# EAGLE design GDOv5 Board (EAGLE 7.5.0)
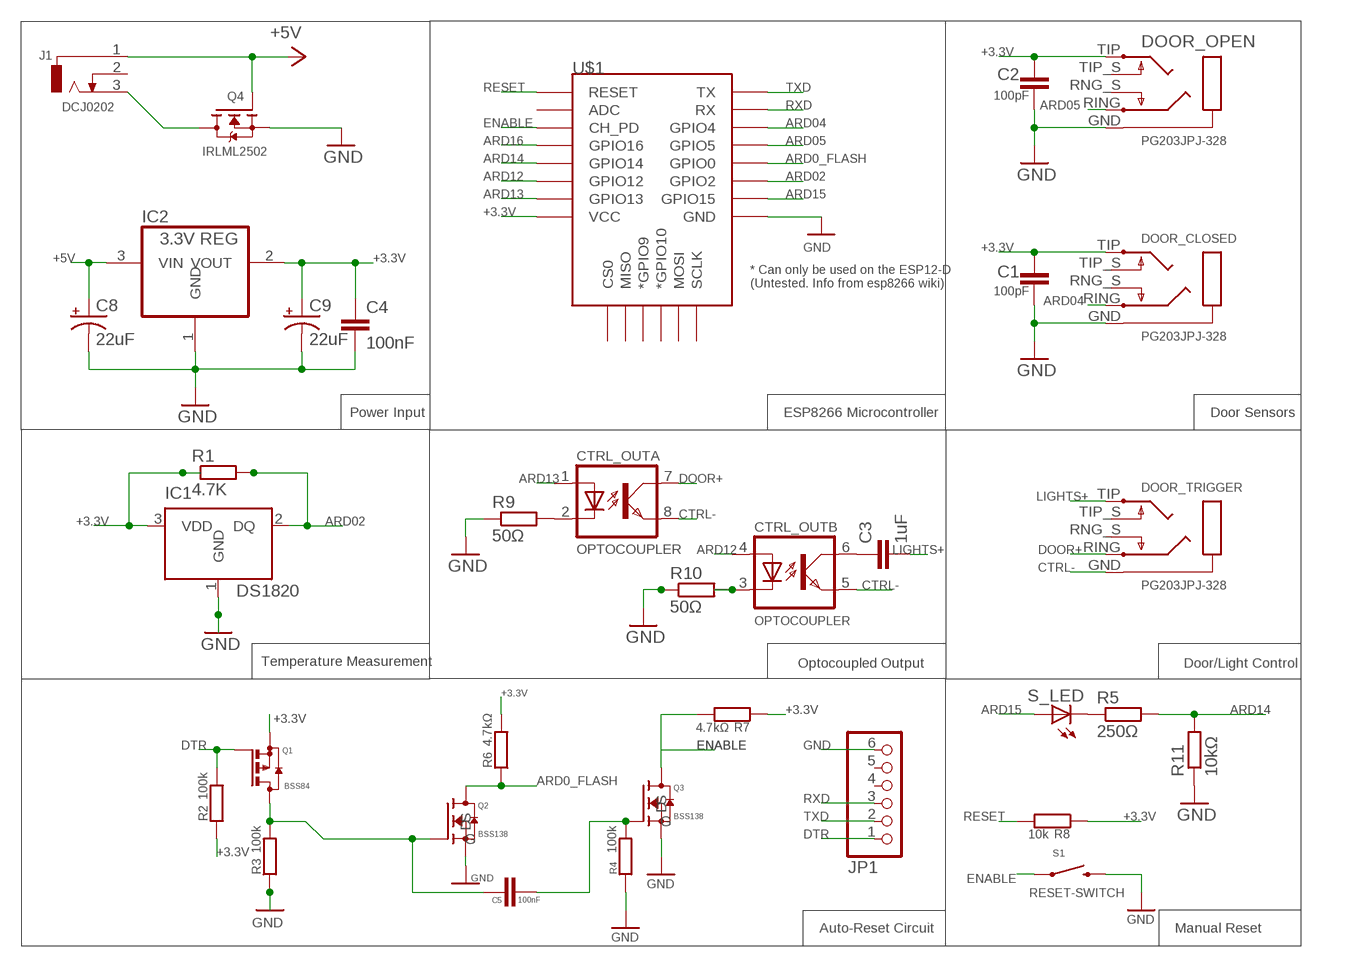
[diagram p0: schematic, sheet 1]

## Parts
C1  100pF  C-EUC1206  [C1206]
C2  100pF  C-EUC1206  [C1206]
C3  1uF  CAP1206  [1206]
C4  100nF  C-EUC1206  [C1206]
C5  100nF  C-EUC1206  [C1206]
C8  22uF  10UF-TANT  [EIA3216]
C9  22uF  10UF-TANT  [EIA3216]
CTRL_OUT  OPTOCOUPLER  ILD2  [DIL08]
DOOR_CLOSED  PG203JPJ-328  [PG203J]
DOOR_OPEN  PG203JPJ-328  [PG203J]
DOOR_TRIGGER  PG203JPJ-328  [PG203J]
IC1  DS1820  [TO-92]
IC2  3.3V REG  REG1117  [SOT223]
J1  DCJ0202  [DCJ0202]
JP1  PINHD-1X6  [1X06]
Q1  BSS84  [SOT23]
Q2  BSS138  [BSS138]
Q3  BSS138  [BSS138]
Q4  IRLML2502  BSS138  [SOT23]
R1  4.7K  R-EU_M3216  [M3216]
R2  100k  R-EU_M3216  [M3216]
R3  100k  R-EU_M3216  [M3216]
R4  100k  R-EU_M3216  [M3216]
R5  250Ω  R-EU_M3216  [M3216]
R6  4.7kΩ  R-EU_M3216  [M3216]
R7  4.7kΩ  R-EU_M3216  [M3216]
R8  10k  R-EU_M3216  [M3216]
R9  50Ω  R-EU_M3216  [M3216]
R10  50Ω  R-EU_M3216  [M3216]
R11  10kΩ  R-EU_M3216  [M3216]
S1  RESET-SWITCH  SWITCH-MOMENTARY-2-SMD-1101NE  [TACTILE-SWITCH-1101NE]
S_LED  LED5MM  [LED5MM]
U$1  ESP12ESMD  [ESP12E-SMD]

## Nets
+3.3V: C1.1 C2.1 C4.1 C9.A(+) DOOR_CLOSED.TIP DOOR_OPEN.TIP IC1.3(VDD) IC2.2(VOUT) Q1.2(S) R1.1 R2.1 R6.2 R7.1 R8.1 U$1.VCC
+5V: C8.A(+) IC2.3(VIN) J1.1 Q4.1(G)
ARD0_FLASH: Q2.D R6.1 U$1.GPIO0
ARD02: IC1.2(DQ) R1.2 U$1.GPIO2
ARD04: DOOR_CLOSED.RING U$1.GPIO4
ARD05: DOOR_OPEN.RING U$1.GPIO5
ARD12: CTRL_OUT.4(B:A) U$1.GPIO12
ARD13: CTRL_OUT.1(A:A) U$1.GPIO13
ARD14: R5.2 R11.2 U$1.GPIO14
ARD15: S_LED.A U$1.GPIO15
ARD16: U$1.GPIO16
CTRL-: CTRL_OUT.5(B:EMIT) CTRL_OUT.8(A:EMIT) DOOR_TRIGGER.GND
DOOR+: CTRL_OUT.7(A:COL) DOOR_TRIGGER.RING
DTR: JP1.1 Q1.1(G) R2.2
ENABLE: Q3.D R7.2 S1.P$1 U$1.CH_PD
GND: C1.2 C2.2 C4.2 C8.C(-) C9.C(-) DOOR_CLOSED.GND DOOR_OPEN.GND IC1.1(GND) IC2.1(GND) JP1.6 Q2.S Q3.S Q4.2(S) R3.1 R4.1 R9.1 R10.1 R11.1 S1.P$2 U$1.GND
LIGHTS+: C3.2 DOOR_TRIGGER.TIP
N$1: J1.3 Q4.3(D)
N$2: C5.2 Q3.G R4.2
N$3: C3.1 CTRL_OUT.6(B:COL)
N$4: R5.1 S_LED.K(C)
N$5: C5.1 Q1.3(D) Q2.G R3.2
N$6: CTRL_OUT.2(A:C) R9.2
N$7: CTRL_OUT.3(B:C) R10.2
RESET: R8.2 U$1.RESET
RXD: JP1.3 U$1.RXD0(RX)
TXD: JP1.2 U$1.TXD0(TX)
Unconnected: DOOR_CLOSED.RNG_S DOOR_CLOSED.TIP_S DOOR_OPEN.RNG_S DOOR_OPEN.TIP_S DOOR_TRIGGER.RNG_S DOOR_TRIGGER.TIP_S J1.2 JP1.4 JP1.5 U$1.ADC U$1.CS0 U$1.GPIO9(*GPIO9) U$1.GPIO10(*GPIO10) U$1.MISO U$1.MOSI U$1.SCLK

## Notes on the sheet
- Power Input | ESP8266 Microcontroller | Door Sensors
- Temperature Measurement | Optocoupled Output | Door/Light Control
- Auto-Reset Circuit | Manual Reset

## Library data of the parts
C1 C2 C4 C5 = resistor:C-EU: CAPACITOR, European symbol
C3 = SparkFun-Capacitors:CAP: Capacitor Standard 0603 ceramic capacitor, and 0.1" leaded capacitor.
C8 C9 = SparkFun-Capacitors:10UF-TANT: 10uF Tantalum SMT CAP-00811- 16V 10% (EIA-3216); PROD_ID: CAP-00811; VALUE: 10uF
CTRL_OUT = optocoupler:ILD2: SIEMENS OPTO COUPLER; OC_FARNELL: 1469596; OC_NEWARK: unknown
DOOR_CLOSED DOOR_OPEN DOOR_TRIGGER = PJ-328 Jack:PG203J: 3.5mm Mic/Headphone Jack Stereo microphone/headphone jack PJ-328
IC1 = DS1820:DS1820: DS1820 - 1-Wire Digital Thermometer
IC2 = burr-brown:REG1117: 800mA and 1A Low Dropout (LDO) Positive Regulator 1.8V, 2.5V, 2.85V, 3.3V, 5V, and Adj; MPN: REG1117; OC_FARNELL: 1097566; OC_NEWARK: 14P6981
J1 = con-jack:DCJ0202: DC POWER JACK Source: DCJ0202.pdf; OC_FARNELL: unknown; OC_NEWARK: unknown
JP1 = adafruit:PINHD-1X6: PIN HEADER
Q1 = transistor-small-signal:BSS84: P-CHANNEL MOS FET
Q2 Q3 = Ava:BSS138: BSS138 N-Channel Logic Level Enhancement Mode Field Effect Transistor Source: http://www.fairchildsemi.com/datasheets/BS/BSS138.pdf
Q4 = bss138_10:BSS138: BSS138 N-Channel Logic Level Enhancement Mode Field Effect Transistor Source: http://www.fairchildsemi.com/datasheets/BS/BSS138.pdf; MF: Fairchild; MPN: BSS138; OC_FARNELL: 9845330; OC_NEWARK: 67R2009
R1-R11 = resistor:R-EU_: RESISTOR, European symbol
S1 = SparkFun-Electromechanical:SWITCH-MOMENTARY-2: Various NO switches- pushbuttons, reed, etc
S_LED = adafruit:LED: LED OSRAM: - CHIPLED LG R971, LG N971, LY N971, LG Q971, LY Q971, LO R971, LY R971 LH N974, LH R974 LS Q976, LO Q976, LY Q976 LO Q996 - Hyper CHIPLED LW Q18S LB Q993, LB Q99A, LB R99A - SideLED LS A670, LO A670, LY A670, LG A670, LP A670 LB A673, LV A673, LT A673, LW A673 LH A674 LY A675 LS A676, LA A676, LO A676, LY A676, LW A676 LS A679, LY A679, LG A679 - Hyper Micro SIDELED® LS Y876, LA Y876, LO Y876, LY Y876 LT Y87S - SmartLED LW L88C, LW L88S LB L89C, LB L89S, LG L890 LS L89K, LO L89K, LY L89K LS L896, LA L896, LO L896, LY L896 - TOPLED LS T670, LO T670, LY T670, LG T670, LP T670 LSG T670, LSP T670, LSY T670, LOP T670, LYG T670 LG T671, LOG T671, LSG T671 LB T673, LV T673, LT T673, LW T673 LH T674 LS T676, LA T676, LO T676, LY T676, LB T676, LH T676, LSB T676, LW T676 LB T67C, LV T67C, LT T67C, LS T67K, LO T67K, LY T67K, LW E67C LS E67B, LA E67B, LO E67B, LY E67B, LB E67C, LV E67C, LT E67C LW T67C LS T679, LY T679, LG T679 LS T770, LO T770, LY T770, LG T770, LP T770 LB T773, LV T773, LT T773, LW T773 LH T774 LS E675, LA E675, LY E675, LS T675 LS T776, LA T776, LO T776, LY T776, LB T776 LHGB T686 LT T68C, LB T68C - Hyper Mini TOPLED® LB M676 - Mini TOPLED Santana® LG M470 LS M47K, LO M47K, LY M47K Source: http://www.osram.convergy.de/
U$1 = esp8266modules:ESP12E: ESP12E Module

## Board
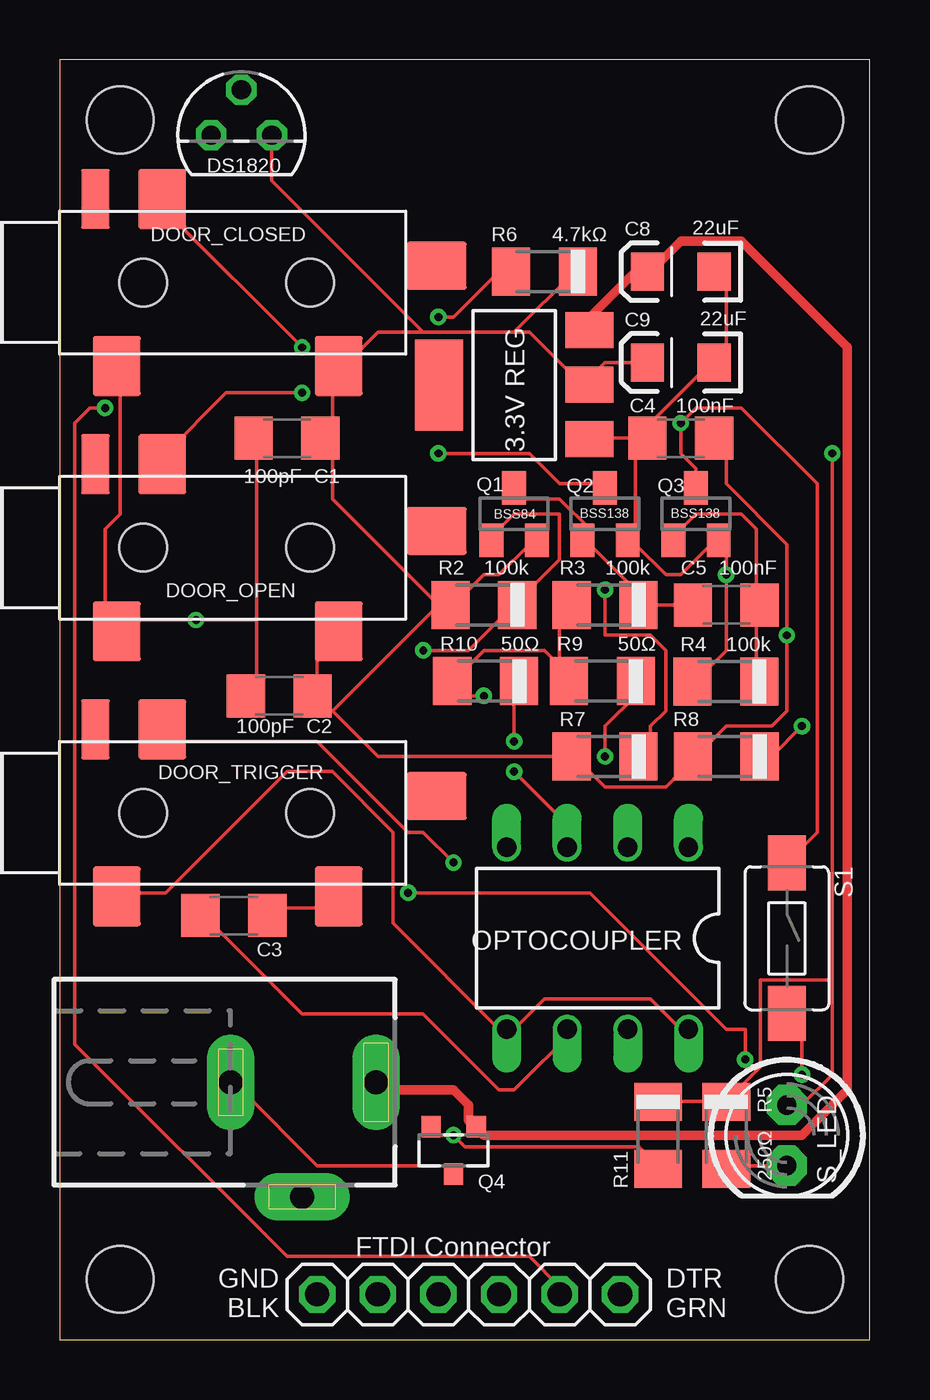
[diagram p1: board, top side]
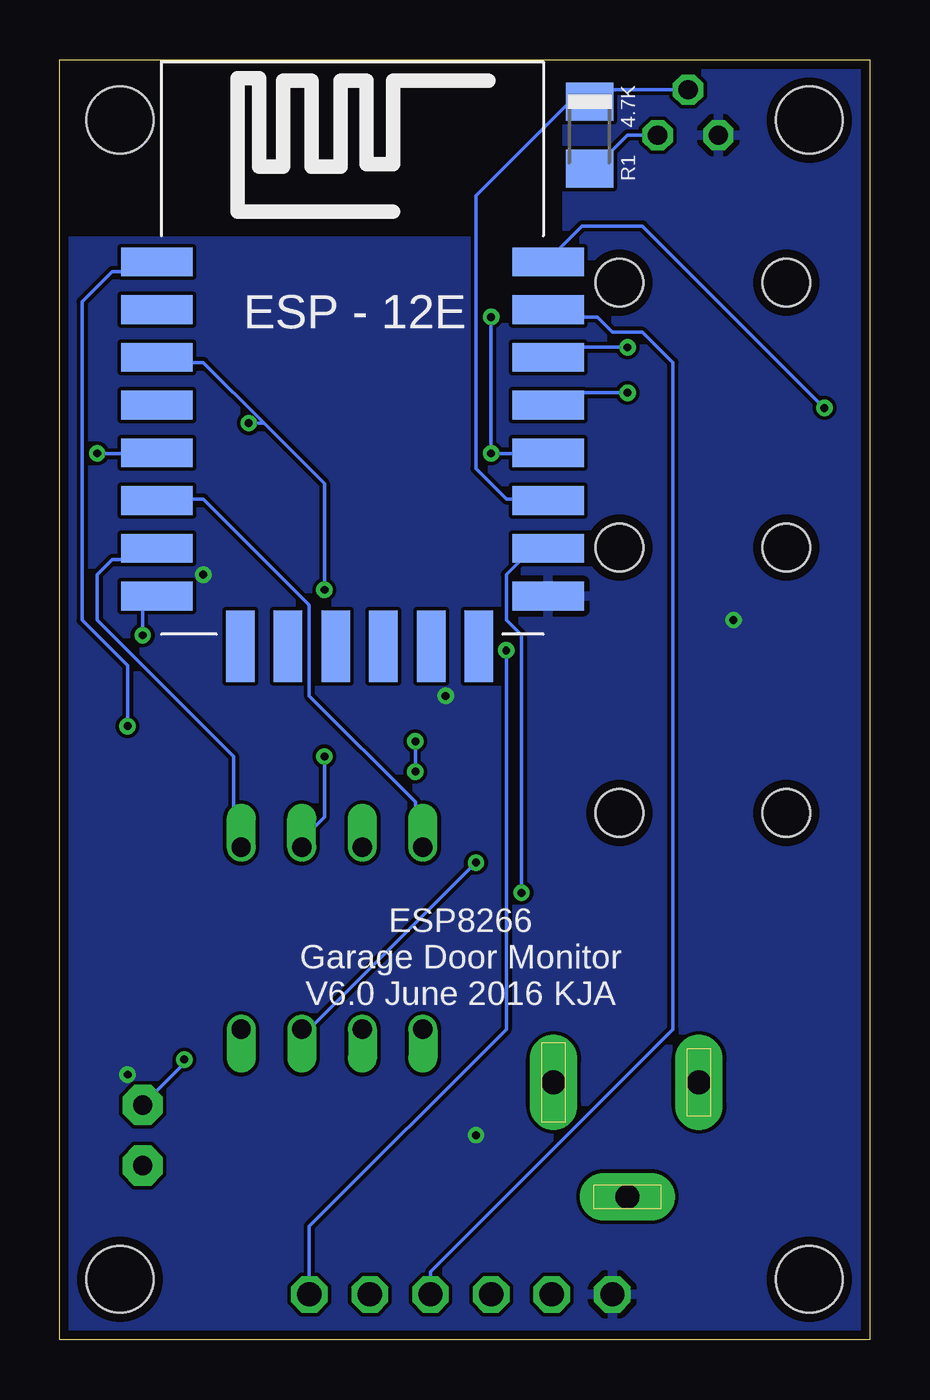
[diagram p2: board, bottom side, seen from below]

Size 33.96 x 53.65 mm. Coordinates in mm from the lower left corner, seen from the top.
Outline: 0,0 33.96,0 33.96,53.65 0,53.65 0,0
Copper layers (1*16): Top 0.0356mm / dielectric 1.5011mm / Bottom 0.0356mm
Design rules "oshpark-2layer": minimum track width 6mil, minimum drill 13mil, track to track 6mil, track to pad 6mil, pad to pad 6mil, via to via 6mil, smd to smd 6mil, copper to edge 15mil, drill to drill 6mil, minimum pad ring 7mil, minimum via ring 7mil, stop-mask expansion 2.5mil, vias tented up to drill 0mil, thermal gap 10mil
Holes 2.8 mm at 2.54,51.12 31.43,51.12 31.43,2.54 2.54,2.54
tRestrict: area 13.3,46.7 to 33.3,53.3

### Footprints (pad centres in the part's own frame; a part is rotated, then mirrored left to right if it is on the bottom)
C1206 = smd 1.6 x 1.8: 1 -1.4,0; 2 1.4,0
1206 = smd 1.6 x 1.8: 1 -1.4,0; 2 1.4,0
EIA3216 = smd 1.4 x 1.6: A 1.4,0; C -1.4,0
DIL08 = drill 0.813 offset: 1 -3.81,-3.81; 2 -1.27,-3.81; 3 1.27,-3.81; 4 3.81,-3.81; 5 3.81,3.81; 6 1.27,3.81; 7 -1.27,3.81; 8 -3.81,3.81
PG203J = smd 2 x 2.5: GND 2.4,-6.5; RING 4.3,0.5; TIP 11.7,-6.5 | smd 1.2 x 2.5: RNG_S 1.5,0.5 | smd 2.5 x 2: TIP_S 15.8,-2.3 | hole 2: 3.5,-3; 10.5,-3
TO-92 = drill 0.813 pad 1.27 octagon: 1 -1.27,0; 2 0,1.905; 3 1.27,0
SOT223 = smd 1.499 x 2.007: 1 -2.261,-3.15; 2 0.025,-3.15; 3 2.311,-3.15 | smd 3.81 x 2.007: 4 0,3.15
DCJ0202 = drill 1 pad 2 long: 1 0,3.1; 2 4.8,0; 3 0,-3
1X06 = drill 1.016 octagon: 1 -6.35,0; 2 -3.81,0; 3 -1.27,0; 4 1.27,0; 5 3.81,0; 6 6.35,0
SOT23 = smd 1 x 1.4: 1 -0.95,-1.1; 2 0.95,-1.1; 3 0,1.1
BSS138 = smd 1 x 1.4: D 0,1.1; G -0.95,-1.1; S 0.95,-1.1
SOT23' = smd 0.8 x 0.9: 1 -0.95,-1; 2 0.95,-1; 3 0,1
M3216 = smd 1.6 x 2: 1 -1.4,0; 2 1.4,0
TACTILE-SWITCH-1101NE = smd 2.3 x 1.6: P$1 -3.15,0; P$2 3.15,0
LED5MM = drill 0.813 pad 1.676 octagon: A -1.27,0; K 1.27,0
ESP12E-SMD = smd 3 x 1.2: ADC -8.3,3.8; CH_PD -8.3,1.8; GND 8.1,-8.2; GPIO0 8.1,-2.2; GPIO2 8.1,-4.2; GPIO4 8.1,1.8; GPIO5 8.1,-0.2; GPIO12 -8.3,-4.2; GPIO13 -8.3,-6.2; GPIO14 -8.3,-2.2; GPIO15 8.1,-6.2; GPIO16 -8.3,-0.2; RESET -8.3,5.8; RXD0 8.1,3.8; TXD0 8.1,5.8; VCC -8.3,-8.2 | smd 1.2 x 3: CS0 -4.8,-10.3; GPIO9 -0.8,-10.3; GPIO10 1.2,-10.3; MISO -2.8,-10.3; MOSI 3.2,-10.3; SCLK 5.2,-10.3

### Placement (x,y rotation side)
C1  9.53,37.78 180 top
C2  9.21,26.99 180 top
C3  7.3,17.78 0 top
C4  26.04,37.78 180 top
C5  27.94,30.8 0 top
C8  26.04,44.77 180 top
C9  26.04,40.96 180 top
CTRL_OUT  22.54,16.83 180 top
DOOR_CLOSED  0,47.31 0 top
DOOR_OPEN  0,36.2 0 top
DOOR_TRIGGER  0,25.08 0 top
IC1  7.62,50.48 0 top
IC2  19.05,40.01 90 top
J1  10.16,10.8 270 top
JP1  17.14,1.91 180 top
Q1  19.05,34.61 0 top
Q2  22.86,34.61 0 top
Q3  26.67,34.61 0 top
Q4  IRLML2502  [SOT23']  16.51,7.94 180 top
R1  11.75,50.48 90 bottom
R2  17.78,30.8 0 top
R3  22.86,30.8 0 top
R4  27.93,27.59 0 top
R5  27.94,8.57 90 top
R6  20.32,44.77 0 top
R7  22.86,24.45 0 top
R8  27.94,24.45 0 top
R9  22.75,27.61 0 top
R10  17.86,27.61 0 top
R11  25.08,8.57 90 top
S1  30.48,16.83 270 top
S_LED  30.48,8.57 270 top
U$1  21.59,39.37 0 bottom

### Tracks (layer width: path | path; a pad name or v marks a point on that pad's centre or on a via)
+3.3V  (via drill 0.33)
  Top 0.152: C9.A 22.86,40.96 22.23,40.32 IC2.2 21.59,40.32 19.68,42.23 19.05,42.23 | 11.43,37.78 11.43,40.32 DOOR_CLOSED.TIP 12.06,40.96 13.34,42.23 15.24,42.23 | 19.05,42.23 21.59,44.77 R6.2 | 15.24,42.23 19.05,42.23 | IC1.3 8.89,48.58 15.24,42.23 | C4.1 27.94,37.78 27.94,35.88 30.48,33.34 v30.48,29.53 30.48,26.35 29.84,25.72 27.94,25.72 26.67,24.45 R8.1 26.04,24.45 26.04,23.81 25.4,23.18 22.86,23.18 21.59,24.45 R7.1 13.34,24.45 11.43,26.35 | Q1.2 19.68,33.34 18.41,32.07 17.78,32.07 16.51,30.8 R2.1 15.88,30.8 | 10.79,26.99 10.79,28.89 11.43,29.53 DOOR_OPEN.TIP | 10.79,26.99 11.43,26.35 | 10.79,26.99 C2.1 | 11.43,26.35 15.88,30.8 | 11.43,37.78 11.43,35.24 15.88,30.8 | 11.43,37.78 C1.1
  Bottom 0.152: IC1.3 10.16,50.48 11.43,49.21 R1.1 | v30.48,29.53 30.48,30.8 U$1.VCC
+5V
  Top 0.152: 24.13,44.77 C8.A 24.77,44.77 | 22.23,42.86 IC2.3 | 17.14,9.21 Q4.1
  Top 0.406: 22.23,42.86 24.13,44.77 | 17.14,9.21 17.14,9.84 16.51,10.48 13.34,10.48 J1.1 | 24.77,44.77 26.04,46.04 28.57,46.04 33.02,41.59 33.02,10.48 31.11,8.57 17.78,8.57 Q4.1
ARD0_FLASH  (via drill 0.33)
  Top 0.152: v15.88,37.15 19.68,37.15 20.95,35.88 22.86,35.88 Q2.D | v15.88,42.86 16.51,42.86 18.41,44.77 R6.1
  Bottom 0.152: U$1.GPIO0 13.97,37.15 v15.88,37.15 v15.88,42.86
ARD02
  Bottom 0.152: IC1.2 11.43,52.39 R1.2 12.06,52.39 16.51,47.94 16.51,36.51 15.24,35.24 13.97,35.24 U$1.GPIO2
ARD04  (via drill 0.33)
  Top 0.152: v10.16,41.59 4.45,47.31 DOOR_CLOSED.RING
  Bottom 0.152: v10.16,41.59 13.34,41.59 U$1.GPIO4
ARD05  (via drill 0.33)
  Top 0.152: v10.16,39.69 6.99,39.69 4.45,37.15 DOOR_OPEN.RING
  Bottom 0.152: v10.16,39.69 13.34,39.69 U$1.GPIO5
ARD12
  Bottom 0.152: CTRL_OUT.4 19.05,20.64 19.05,22.54 23.5,26.99 23.5,30.8 27.94,35.24 29.84,35.24 U$1.GPIO12
ARD13
  Bottom 0.152: CTRL_OUT.1 26.67,20.64 26.67,24.45 32.38,30.16 32.38,32.07 31.75,32.7 30.48,32.7 U$1.GPIO13
ARD14  (via drill 0.33)
  Top 0.152: 32.38,15.08 32.38,11.11 31.11,9.84 | 32.38,15.08 v32.38,37.15 | 27.94,10 25.08,10 R11.2 | 27.94,10 29.37,11.43 29.37,15.08 32.38,15.08 | 27.94,10 R5.2
  Bottom 0.152: v32.38,37.15 30.48,37.15 U$1.GPIO14
ARD15  (via drill 0.33)
  Top 0.152: v14.61,18.73 22.23,18.73 27.94,13.02 28.73,13.02 v28.73,11.75
  Bottom 0.152: v14.61,18.73 14.61,29.53 15.24,30.16 15.24,32.07 13.97,33.34 U$1.GPIO15 | S_LED.A 28.73,11.59 v28.73,11.75
CTRL-
  Top 0.152: CTRL_OUT.8 26.04,13.02 24.77,14.29 20.32,14.29 19.05,13.02 CTRL_OUT.5 18.41,13.02 13.97,17.46 13.97,21.27 11.43,23.81 9.53,23.81 4.45,18.73 2.54,18.73 DOOR_TRIGGER.GND
DOOR+  (via drill 0.33)
  Top 0.152: v16.51,20 15.24,21.27 14.61,21.27 10.79,25.08 4.45,25.08 DOOR_TRIGGER.RING
  Bottom 0.152: v16.51,20 23.5,13.02 CTRL_OUT.7
DTR  (via drill 0.33)
  Top 0.152: 19.05,30.8 20.95,32.7 20.95,34.61 19.05,34.61 18.41,33.97 Q1.1 | v15.24,28.89 17.14,28.89 19.05,30.8 | 19.05,30.8 R2.2
  Bottom 0.152: JP1.1 23.5,4.76 15.24,13.02 v15.24,28.89
ENABLE  (via drill 0.33)
  Top 0.152: Q3.D 26.67,36.51 26.04,37.15 v26.04,38.42 26.67,39.05 28.57,39.05 31.75,35.88 31.75,21.27 30.48,20 S1.P$1 | v22.86,31.43 22.86,29.53 24.77,29.53 25.4,28.89 25.4,26.35 24.77,25.72 24.77,24.45 R7.2
  Bottom 0.152: v22.86,31.43 22.86,35.88 25.4,38.42 | 25.4,38.42 27.94,40.96 29.84,40.96 U$1.CH_PD | 25.4,38.42 v26.04,38.42
GND  (via drill 0.33)
  Top 0.152: R4.1 26.67,27.62 27.94,28.89 v27.94,32.07 27.94,33.34 Q3.S 27.3,33.34 26.04,32.07 25.4,32.07 24.13,33.34 Q2.S 24.13,33.97 24.13,37.78 | C8.C 27.94,44.77 27.94,40.96 C9.C 27.3,40.96 24.13,37.78 | 24.13,37.78 22.23,37.78 IC2.1 | 24.13,37.78 C4.2 | 8.26,30.16 8.26,37.78 C1.2 | 8.26,30.16 8.26,26.99 C2.2 | 8.26,30.16 v5.71,30.16 2.54,30.16 DOOR_OPEN.GND 1.91,30.16 1.91,33.97 2.54,34.61 2.54,40.32 DOOR_CLOSED.GND | 20.95,28.26 21.59,27.62 R9.1 20.95,28.26 | 20.95,28.26 20.32,28.89 17.78,28.89 16.51,27.62 R10.1 16.51,26.99 v17.78,26.99 | 20.95,28.26 20.95,30.8 R3.1 | Q4.2 15.88,8.57 v16.51,8.57 16.99,8.1 24.29,8.1 25.08,7.3 R11.1 | v31.11,11.11 31.11,13.02 30.48,13.65 S1.P$2
  pour Bottom: 0,0.32 33.66,0.32 33.66,46.04 12.7,46.04 12.7,53.66 0,53.66
LIGHTS+
  Top 0.152: C3.2 8.89,18.1 11.43,18.1 DOOR_TRIGGER.TIP
N$1
  Top 0.152: Q4.3 16.51,7.3 10.79,7.3 7.62,10.48 J1.3
N$2
  Top 0.152: 29.21,30.8 29.21,33.97 28.57,34.61 26.67,34.61 26.04,33.97 Q3.G | 29.21,30.8 29.21,27.62 R4.2 | 29.21,30.8 C5.2
N$3
  Top 0.152: C3.1 6.35,17.46 10.16,13.65 15.24,13.65 18.41,10.48 19.05,10.48 21.59,13.02 CTRL_OUT.6
N$4
  Top 0.152: S_LED.K 27.94,7.3 R5.1
N$5
  Top 0.152: 24.77,30.8 22.23,33.34 Q2.G 22.23,33.97 20.95,35.24 19.05,35.24 Q1.3 | 24.77,30.8 C5.1 | 24.77,30.8 R3.2
N$6  (via drill 0.33)
  Top 0.152: v22.86,24.45 22.86,25.72 24.13,26.99 R9.2
  Bottom 0.152: v22.86,24.45 22.86,21.91 24.13,20.64 CTRL_OUT.2
N$7  (via drill 0.33)
  Top 0.152: v19.05,25.08 19.05,26.99 R10.2 | v19.05,23.81 20.95,21.91 20.95,20.64 CTRL_OUT.3
  Bottom 0.152: v19.05,23.81 v19.05,25.08
RESET  (via drill 0.33)
  Top 0.152: v31.11,25.72 29.84,24.45 R8.2
  Bottom 0.152: v31.11,25.72 31.11,28.26 33.02,30.16 33.02,43.5 31.75,44.77 30.48,44.77 U$1.RESET
RXD
  Bottom 0.152: JP1.3 18.41,2.86 8.26,13.02 8.26,40.96 9.53,42.23 10.79,42.23 11.43,42.86 13.34,42.86 U$1.RXD0
TXD  (via drill 0.33)
  Top 0.152: v1.91,39.05 1.27,39.05 0.64,38.42 0.64,12.38 9.53,3.49 19.68,3.49 20.95,2.22 JP1.2
  Bottom 0.152: v1.91,39.05 9.53,46.67 12.06,46.67 13.34,45.4 U$1.TXD0

### Text on the board
tNames: FTDI Connector | GND / BLK | DTR / GRN
bNames: ESP8266 / Garage Door Monitor / V6.0 June 2016 KJA